# EAGLE schematic Filter Board (EAGLE 9.5.1)
REV#: 1

## Sheet 1 of 5
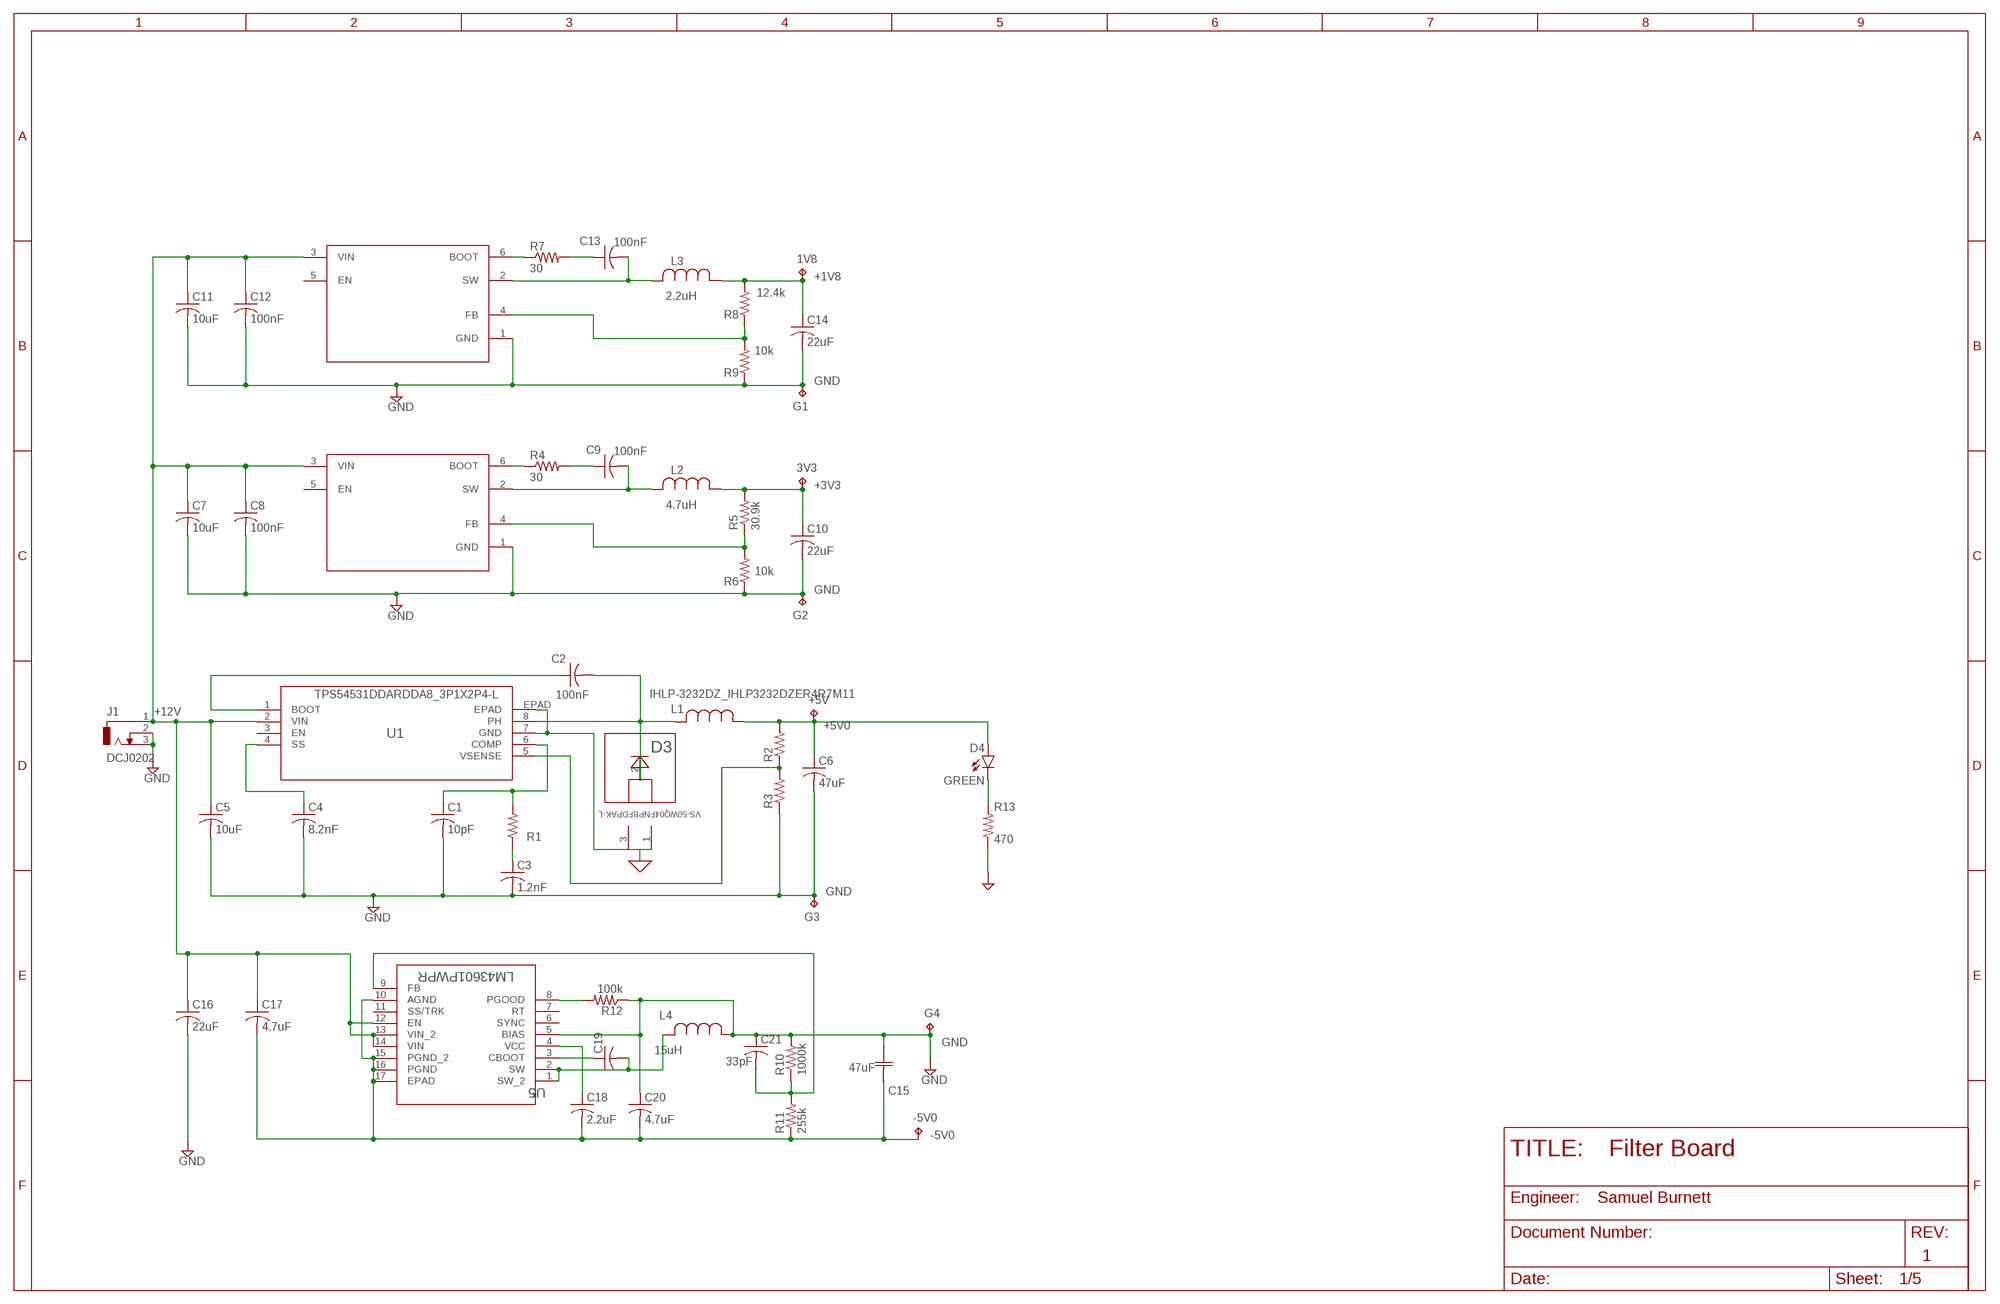
[diagram p0: schematic, sheet 1]
FRAME5 (FRAME_B_L): ENGINEER_NAME: Samuel Burnett

### Parts
1V8  TPPAD1-13  [P1-13]
3V3  TPPAD1-13  [P1-13]
+5V  TPPAD1-13  [P1-13]
-5V0  TPPAD1-13  [P1-13]
C1  10pF  C-USC0805  [C0805]
C2  100nF  C-USC0805  [C0805]
C3  1.2nF  C-USC0805  [C0805]
C4  8.2nF  C-USC1206  [C1206]
C5  10uF  C-USC1210  [C1210]
C6  47uF  C-USC1210  [C1210]
C7  10uF  C-USC0805  [C0805]
C8  100nF  C-USC0805  [C0805]
C9  100nF  C-USC0805  [C0805]
C10  22uF  C-USC0805  [C0805]
C11  10uF  C-USC0805  [C0805]
C12  100nF  C-USC0805  [C0805]
C13  100nF  C-USC0805  [C0805]
C14  22uF  C-USC0805  [C0805]
C15  47uF  CGA9N3X7R1_CGA9N3X7R1C476M230KB  [CGA9N3X7R1_CAP_5750]
C16  22uF  C-USC1210  [C1210]
C17  4.7uF  C-USC0805  [C0805]
C18  2.2uF  C-USC0805  [C0805]
C19  C-USC0805  [C0805]
C20  4.7uF  C-USC0805  [C0805]
C21  33pF  C-USC0805  [C0805]
D3  VS-50WQ04FNPBFDPAK-L  [DPAK-L]
D4  GREEN  LED-BLUE1206  [LED-1206]
G1  TPPAD1-13  [P1-13]
G2  TPPAD1-13  [P1-13]
G3  TPPAD1-13  [P1-13]
G4  TPPAD1-13  [P1-13]
J1  DCJ0202  [DCJ0202]
L1  IHLP-3232DZ_IHLP3232DZER4R7M11  [IHLP-3232DZ_IND_IHLP-3232DZ]
L2  4.7uH  LTF5022T  [IND_5022]
L3  2.2uH  NLCV32T-2R2M-PFR  [IND_NLCV32TR]
L4  15uH  IFSC-1515A_IFSC1515AHER150M01  [IFSC-1515A_IND_IFSC_1515AH]
R1  R-US_R0805  [R0805]
R2  R-US_R0805  [R0805]
R3  R-US_R0805  [R0805]
R4  30  R-US_R0805  [R0805]
R5  30.9k  R-US_R0805  [R0805]
R6  10k  R-US_R0805  [R0805]
R7  30  R-US_R0805  [R0805]
R8  12.4k  R-US_R0805  [R0805]
R9  10k  R-US_R0805  [R0805]
R10  1000k  R-US_R0805  [R0805]
R11  255k  R-US_R0805  [R0805]
R12  100k  R-US_R0805  [R0805]
R13  470  R-US_R0805  [R0805]
U1  TPS54531DDARDDA8_3P1X2P4-L  [DDA8_3P1X2P4-L]
U3  TPS56339  [TSOT23-6_DDC]
U4  TPS56339  [TSOT23-6_DDC]
U5  LM43601PWPR  [PWP16]

### Nets
+1V8 [Power]: 1V8.TP C14.1 L3.1 R8.2 ; also sheet 5
+3V3 [Power]: 3V3.TP C10.1 L2.1 R5.2 ; also sheet 2,5
+5V0 [Power]: +5V.TP C6.1 D4.A L1.1 R2.2 ; also sheet 2,5
+12V: C5.1 C7.1 C8.1 C11.1 C12.1 C16.1 C17.1 J1.1 U1.2(VIN) U3.3(VIN) U4.3(VIN) U5.12(EN) U5.13(VIN_2) U5.14(VIN) ; also sheet 5
-5V0 [Power]: -5V0.TP C15.2 C17.2 C18.2 C20.2 R11.1 U5.10(AGND) U5.15(PGND_2) U5.16(PGND) U5.17(EPAD) ; also sheet 2,5
BOOT: C19.1 U5.3(CBOOT)
FB: C21.2 R10.1 R11.2 U5.9(FB)
GND [GND]: C1.2 C3.2 C4.2 C5.2 C6.2 C7.2 C8.2 C10.2 C11.2 C12.2 C14.2 C15.1 C16.2 C20.1 C21.1 D3.1 D3.3 G1.TP G2.TP G3.TP G4.TP J1.2 J1.3 L4.1 R3.1 R6.1 R9.1 R10.2 R12.1 R13.1 U1.7(GND) U1.EPAD U3.1(GND) U4.1(GND) U5.5(BIAS) ; also sheet 2,3,4,5
N$1: C3.1 R1.1
N$2: R2.1 R3.2 U1.5(VSENSE)
N$3: C2.1 U1.1(BOOT)
N$4: C2.2 D3.2 L1.2 U1.8(PH)
N$5: C4.1 U1.4(SS)
N$6: C1.1 R1.2 U1.6(COMP)
N$7: R4.1 U3.6(BOOT)
N$8: C9.1 R4.2
N$9: C9.2 L2.2 U3.2(SW)
N$10: R7.1 U4.6(BOOT)
N$11: R5.1 R6.2 U3.4(FB)
N$12: C13.1 R7.2
N$13: C13.2 L3.2 U4.2(SW)
N$14: R8.1 R9.2 U4.4(FB)
N$18: C18.1 U5.4(VCC)
N$60: D4.C R13.2
PGOOD: R12.2 U5.8(PGOOD)
SW: C19.2 L4.2 U5.1(SW_2) U5.2(SW)
Unconnected: U1.3(EN) U3.5(EN) U4.5(EN) U5.6(SYNC) U5.7(RT) U5.11(SS/TRK)

## Sheet 2 of 5
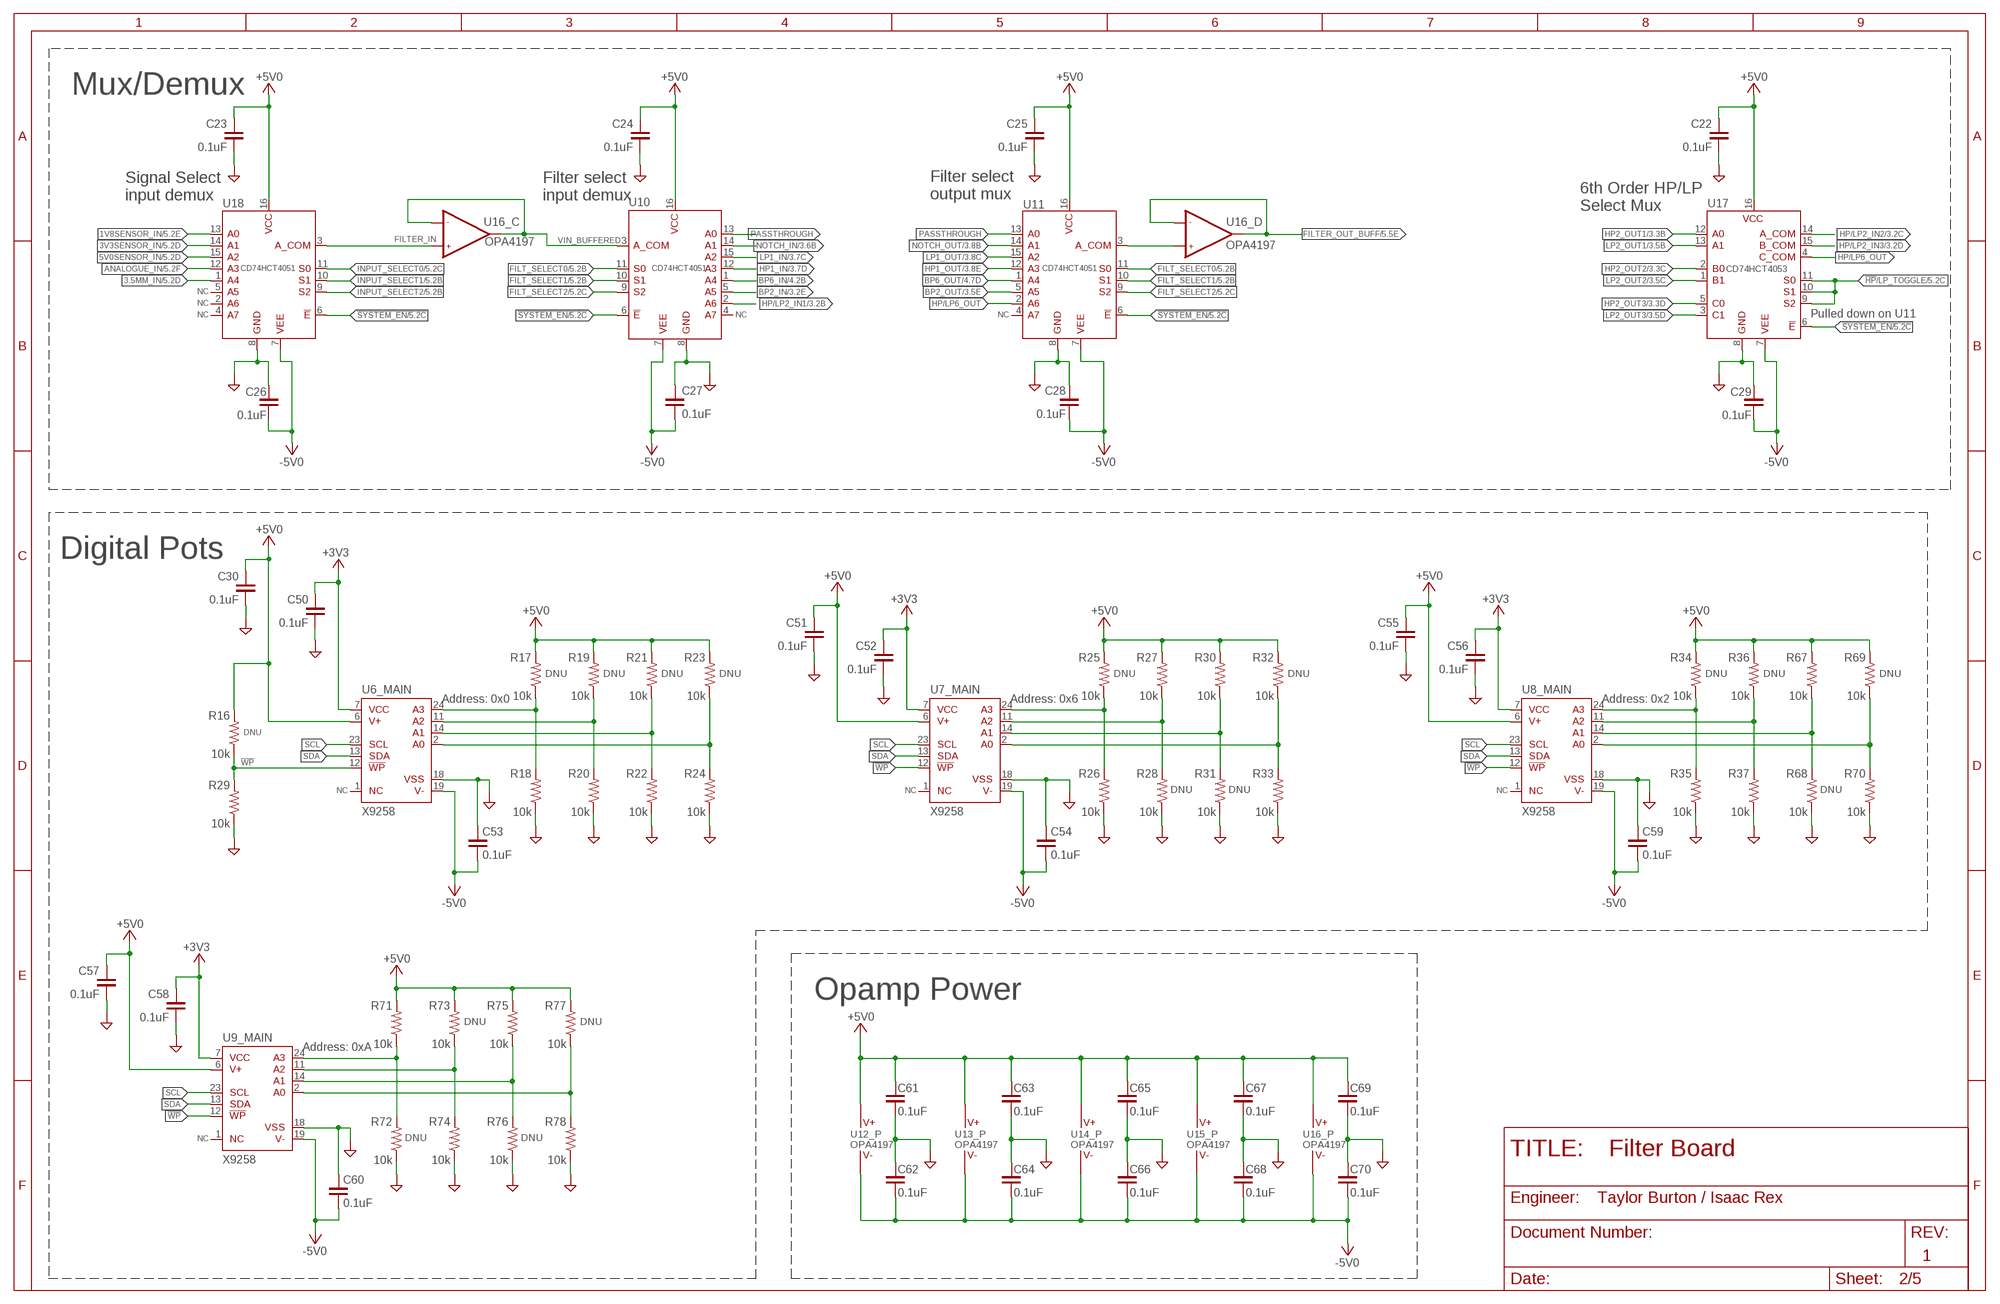
[diagram p1: schematic, sheet 2]
FRAME1 (FRAME_B_L): ENGINEER_NAME: Taylor Burton / Isaac Rex

### Parts
C22  0.1uF  NON_POL_0805/2012  [0805_H0.75]
C23  0.1uF  NON_POL_0805/2012  [0805_H0.75]
C24  0.1uF  NON_POL_0805/2012  [0805_H0.75]
C25  0.1uF  NON_POL_0805/2012  [0805_H0.75]
C26  0.1uF  NON_POL_0805/2012  [0805_H0.75]
C27  0.1uF  NON_POL_0805/2012  [0805_H0.75]
C28  0.1uF  NON_POL_0805/2012  [0805_H0.75]
C29  0.1uF  NON_POL_0805/2012  [0805_H0.75]
C30  0.1uF  NON_POL_0805/2012  [0805_H0.75]
C50  0.1uF  NON_POL_0805/2012  [0805_H0.75]
C51  0.1uF  NON_POL_0805/2012  [0805_H0.75]
C52  0.1uF  NON_POL_0805/2012  [0805_H0.75]
C53  0.1uF  NON_POL_0805/2012  [0805_H0.75]
C54  0.1uF  NON_POL_0805/2012  [0805_H0.75]
C55  0.1uF  NON_POL_0805/2012  [0805_H0.75]
C56  0.1uF  NON_POL_0805/2012  [0805_H0.75]
C57  0.1uF  NON_POL_0805/2012  [0805_H0.75]
C58  0.1uF  NON_POL_0805/2012  [0805_H0.75]
C59  0.1uF  NON_POL_0805/2012  [0805_H0.75]
C60  0.1uF  NON_POL_0805/2012  [0805_H0.75]
C61  0.1uF  NON_POL_0805/2012  [0805_H0.75]
C62  0.1uF  NON_POL_0805/2012  [0805_H0.75]
C63  0.1uF  NON_POL_0805/2012  [0805_H0.75]
C64  0.1uF  NON_POL_0805/2012  [0805_H0.75]
C65  0.1uF  NON_POL_0805/2012  [0805_H0.75]
C66  0.1uF  NON_POL_0805/2012  [0805_H0.75]
C67  0.1uF  NON_POL_0805/2012  [0805_H0.75]
C68  0.1uF  NON_POL_0805/2012  [0805_H0.75]
C69  0.1uF  NON_POL_0805/2012  [0805_H0.75]
C70  0.1uF  NON_POL_0805/2012  [0805_H0.75]
R16  10k  SMD_0805  [0805]
R17  10k  SMD_0805  [0805]
R18  10k  SMD_0805  [0805]
R19  10k  SMD_0805  [0805]
R20  10k  SMD_0805  [0805]
R21  10k  SMD_0805  [0805]
R22  10k  SMD_0805  [0805]
R23  10k  SMD_0805  [0805]
R24  10k  SMD_0805  [0805]
R25  10k  SMD_0805  [0805]
R26  10k  SMD_0805  [0805]
R27  10k  SMD_0805  [0805]
R28  10k  SMD_0805  [0805]
R29  10k  SMD_0805  [0805]
R30  10k  SMD_0805  [0805]
R31  10k  SMD_0805  [0805]
R32  10k  SMD_0805  [0805]
R33  10k  SMD_0805  [0805]
R34  10k  SMD_0805  [0805]
R35  10k  SMD_0805  [0805]
R36  10k  SMD_0805  [0805]
R37  10k  SMD_0805  [0805]
R67  10k  SMD_0805  [0805]
R68  10k  SMD_0805  [0805]
R69  10k  SMD_0805  [0805]
R70  10k  SMD_0805  [0805]
R71  10k  SMD_0805  [0805]
R72  10k  SMD_0805  [0805]
R73  10k  SMD_0805  [0805]
R74  10k  SMD_0805  [0805]
R75  10k  SMD_0805  [0805]
R76  10k  SMD_0805  [0805]
R77  10k  SMD_0805  [0805]
R78  10k  SMD_0805  [0805]
U6  X9258  X9258_SOIC  [SOIC127P1030X250-25T200X300]
U7  X9258  X9258_SOIC  [SOIC127P1030X250-25T200X300]
U8  X9258  X9258_SOIC  [SOIC127P1030X250-25T200X300]
U9  X9258  X9258_SOIC  [SOIC127P1030X250-25T200X300]
U10  CD74HCT4051  [SOIC127P600X144-16]
U11  CD74HCT4051  [SOIC127P600X144-16]
U12  OPA4197  OPA4197_SOIC14  [SOIC127P600X144-14]
U13  OPA4197  OPA4197_SOIC14  [SOIC127P600X144-14]
U14  OPA4197  OPA4197_SOIC14  [SOIC127P600X144-14]
U15  OPA4197  OPA4197_SOIC14  [SOIC127P600X144-14]
U16  OPA4197  OPA4197_SOIC14  [SOIC127P600X144-14]
U17  CD74HCT4053  CD74HCT4053_SOIC16  [SOIC127P600X144-16]
U18  CD74HCT4051  [SOIC127P600X144-16]

### Nets
1V8SENSOR_IN: U18.13(A0) ; also sheet 5
3.5MM_IN: U18.1(A4) ; also sheet 5
3V3SENSOR_IN: U18.14(A1) ; also sheet 5
5V0SENSOR_IN: U18.15(A2) ; also sheet 5
!HP!/LP_TOGGLE: U17.9(S2) U17.10(S1) U17.11(S0) ; also sheet 5
!SYSTEM_EN: U10.6(!E) U11.6(!E) U17.6(!E) U18.6(!E) ; also sheet 5
!WP: R16.1 R29.2 U6.12(_MAIN:!WP) U7.12(_MAIN:!WP) U8.12(_MAIN:!WP) U9.12(_MAIN:!WP)
+3V3 [Power]: C50.1 C52.1 C56.1 C58.1 U6.7(_MAIN:VCC) U7.7(_MAIN:VCC) U8.7(_MAIN:VCC) U9.7(_MAIN:VCC) ; also sheet 1,5
+5V0 [Power]: C22.1 C23.1 C24.1 C25.1 C30.1 C51.1 C55.1 C57.1 C61.1 C63.1 C65.1 C67.1 C69.1 R16.2 R17.2 R19.2 R21.2 R23.2 R25.2 R27.2 R30.2 R32.2 R34.2 R36.2 R67.2 R69.2 R71.2 R73.2 R75.2 R77.2 U6.6(_MAIN:V+) U7.6(_MAIN:V+) U8.6(_MAIN:V+) U9.6(_MAIN:V+) U10.16(VCC) U11.16(VCC) U12.4(_P:V+) U13.4(_P:V+) U14.4(_P:V+) U15.4(_P:V+) U16.4(_P:V+) U17.16(VCC) U18.16(VCC) ; also sheet 1,5
-5V0 [Power]: C26.2 C27.1 C28.2 C29.2 C53.2 C54.2 C59.2 C60.2 C62.2 C64.2 C66.2 C68.2 C70.2 U6.19(_MAIN:V-) U7.19(_MAIN:V-) U8.19(_MAIN:V-) U9.19(_MAIN:V-) U10.7(VEE) U11.7(VEE) U12.11(_P:V-) U13.11(_P:V-) U14.11(_P:V-) U15.11(_P:V-) U16.11(_P:V-) U17.7(VEE) U18.7(VEE) ; also sheet 1,5
ANALOGUE_IN: U18.12(A3) ; also sheet 5
BP2_IN: U10.5(A5) ; also sheet 3
BP2_OUT: U11.5(A5) ; also sheet 3
BP6_IN: U10.1(A4) ; also sheet 4
BP6_OUT: U11.1(A4) ; also sheet 4
FILT_SELECT0: U10.11(S0) U11.11(S0) ; also sheet 5
FILT_SELECT1: U10.10(S1) U11.10(S1) ; also sheet 5
FILT_SELECT2: U10.9(S2) U11.9(S2) ; also sheet 5
FILTER_IN: U16.10(_C:+IN) U18.3(A_COM)
FILTER_OUT_BUFF: U16.13(_D:-IN) U16.14(_D:OUT) ; also sheet 5
GND [GND]: C22.2 C23.2 C24.2 C25.2 C26.1 C27.2 C28.1 C29.1 C30.2 C50.2 C51.2 C52.2 C53.1 C54.1 C55.2 C56.2 C57.2 C58.2 C59.1 C60.1 C61.2 C62.1 C63.2 C64.1 C65.2 C66.1 C67.2 C68.1 C69.2 C70.1 R18.1 R20.1 R22.1 R24.1 R26.1 R28.1 R29.1 R31.1 R33.1 R35.1 R37.1 R68.1 R70.1 R72.1 R74.1 R76.1 R78.1 U6.18(_MAIN:VSS) U7.18(_MAIN:VSS) U8.18(_MAIN:VSS) U9.18(_MAIN:VSS) U10.8(GND) U11.8(GND) U17.8(GND) U18.8(GND) ; also sheet 1,3,4,5
HP1_IN: U10.12(A3) ; also sheet 3
HP1_OUT: U11.12(A3) ; also sheet 3
HP2_OUT1: U17.12(A0) ; also sheet 3
HP2_OUT2: U17.2(B0) ; also sheet 3
HP2_OUT3: U17.5(C0) ; also sheet 3
HP/LP2_IN1: U10.2(A6) ; also sheet 3
HP/LP2_IN2: U17.14(A_COM) ; also sheet 3
HP/LP2_IN3: U17.15(B_COM) ; also sheet 3
HP/LP6_OUT: U11.2(A6) U17.4(C_COM)
INPUT_SELECT0: U18.11(S0) ; also sheet 5
INPUT_SELECT1: U18.10(S1) ; also sheet 5
INPUT_SELECT2: U18.9(S2) ; also sheet 5
LP1_IN: U10.15(A2) ; also sheet 3
LP1_OUT: U11.15(A2) ; also sheet 3
LP2_OUT1: U17.13(A1) ; also sheet 3
LP2_OUT2: U17.1(B1) ; also sheet 3
LP2_OUT3: U17.3(C1) ; also sheet 3
N$27: R17.1 R18.2 U6.24(_MAIN:A3)
N$33: R19.1 R20.2 U6.11(_MAIN:A2)
N$39: R21.1 R22.2 U6.14(_MAIN:A1)
N$43: U11.3(A_COM) U16.12(_D:+IN)
N$44: R23.1 R24.2 U6.2(_MAIN:A0)
N$45: R25.1 R26.2 U7.24(_MAIN:A3)
N$46: R27.1 R28.2 U7.11(_MAIN:A2)
N$47: R30.1 R31.2 U7.14(_MAIN:A1)
N$48: R32.1 R33.2 U7.2(_MAIN:A0)
N$49: R34.1 R35.2 U8.24(_MAIN:A3)
N$50: R36.1 R37.2 U8.11(_MAIN:A2)
N$51: R67.1 R68.2 U8.14(_MAIN:A1)
N$52: R69.1 R70.2 U8.2(_MAIN:A0)
N$53: R71.1 R72.2 U9.24(_MAIN:A3)
N$54: R73.1 R74.2 U9.11(_MAIN:A2)
N$55: R75.1 R76.2 U9.14(_MAIN:A1)
N$56: R77.1 R78.2 U9.2(_MAIN:A0)
NOTCH_IN: U10.14(A1) ; also sheet 3
NOTCH_OUT: U11.14(A1) ; also sheet 3
PASSTHROUGH: U10.13(A0) U11.13(A0)
SCL: U6.23(_MAIN:SCL) U7.23(_MAIN:SCL) U8.23(_MAIN:SCL) U9.23(_MAIN:SCL) ; also sheet 5
SDA: U6.13(_MAIN:SDA) U7.13(_MAIN:SDA) U8.13(_MAIN:SDA) U9.13(_MAIN:SDA) ; also sheet 5
VIN_BUFFERED: U10.3(A_COM) U16.8(_C:OUT) U16.9(_C:-IN)
Unconnected: U6.1(_MAIN:NC) U7.1(_MAIN:NC) U8.1(_MAIN:NC) U9.1(_MAIN:NC) U10.4(A7) U11.4(A7) U18.2(A6) U18.4(A7) U18.5(A5)

### Notes on the sheet
- Mux/Demux
- Filter select 
  output mux
- Signal Select
  input demux
- Filter select 
  input demux
- 6th Order HP/LP 
  Select Mux
- NC
- NC
- NC | NC | NC | Pulled down on U11
- Digital Pots
- Address: 0x0 | Address: 0x6 | Address: 0x2
- NC | NC | NC
- Opamp Power
- Address: 0xA
- NC

## Sheet 3 of 5: Filters 6th Order Bandpass Notch 1st Order Lowpass 1st Order Highpass 2nd Order Bandpass
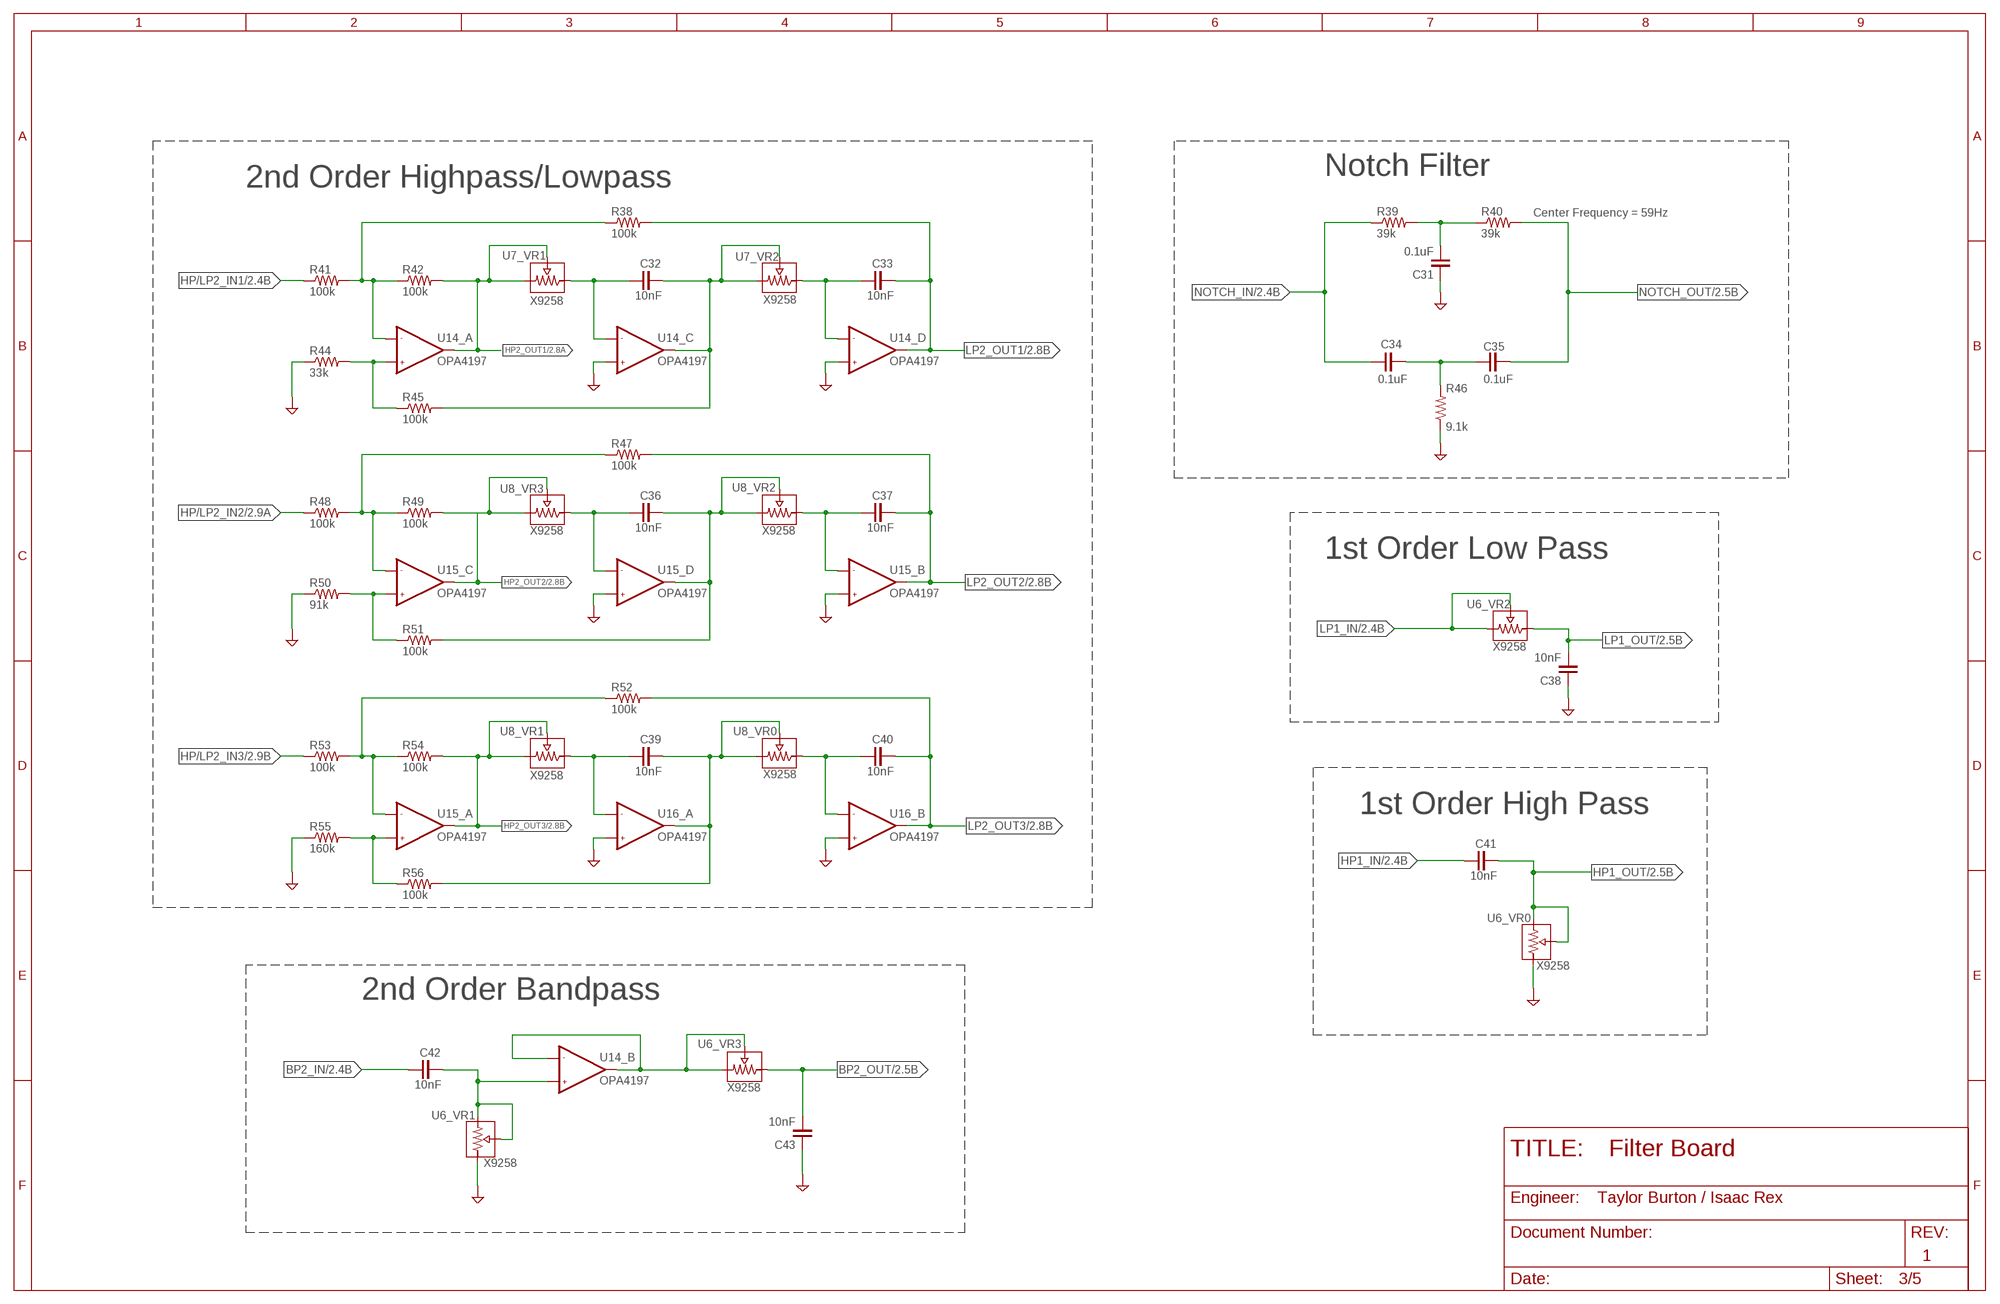
[diagram p2: schematic, sheet 3]
FRAME2 (FRAME_B_L): ENGINEER_NAME: Taylor Burton / Isaac Rex

### Parts
C31  0.1uF  NON_POL_0805/2012  [0805_H0.75]
C32  10nF  NON_POL_0805/2012  [0805_H0.75]
C33  10nF  NON_POL_0805/2012  [0805_H0.75]
C34  0.1uF  NON_POL_0805/2012  [0805_H0.75]
C35  0.1uF  NON_POL_0805/2012  [0805_H0.75]
C36  10nF  NON_POL_0805/2012  [0805_H0.75]
C37  10nF  NON_POL_0805/2012  [0805_H0.75]
C38  10nF  NON_POL_0805/2012  [0805_H0.75]
C39  10nF  NON_POL_0805/2012  [0805_H0.75]
C40  10nF  NON_POL_0805/2012  [0805_H0.75]
C41  10nF  NON_POL_0805/2012  [0805_H0.75]
C42  10nF  NON_POL_0805/2012  [0805_H0.75]
C43  10nF  NON_POL_0805/2012  [0805_H0.75]
R38  100k  SMD_0805  [0805]
R39  39k  SMD_0805  [0805]
R40  39k  SMD_0805  [0805]
R41  100k  SMD_0805  [0805]
R42  100k  SMD_0805  [0805]
R44  33k  SMD_0805  [0805]
R45  100k  SMD_0805  [0805]
R46  9.1k  SMD_0805  [0805]
R47  100k  SMD_0805  [0805]
R48  100k  SMD_0805  [0805]
R49  100k  SMD_0805  [0805]
R50  91k  SMD_0805  [0805]
R51  100k  SMD_0805  [0805]
R52  100k  SMD_0805  [0805]
R53  100k  SMD_0805  [0805]
R54  100k  SMD_0805  [0805]
R55  160k  SMD_0805  [0805]
R56  100k  SMD_0805  [0805]

### Nets
BP2_IN: C42.1 ; also sheet 2
BP2_OUT: C43.2 U6.5(_VR3:L) ; also sheet 2
GND [GND]: C31.1 C38.1 C43.1 R44.1 R46.1 R50.1 R55.1 U6.8(_VR0:L) U6.15(_VR1:L) U14.10(_C:+IN) U14.12(_D:+IN) U15.5(_B:+IN) U15.12(_D:+IN) U16.3(_A:+IN) U16.5(_B:+IN) ; also sheet 1,2,4,5
HP1_IN: C41.1 ; also sheet 2
HP1_OUT: C41.2 U6.9(_VR0:H) U6.10(_VR0:W) ; also sheet 2
HP2_OUT1: R42.2 U7.16(_VR1:H) U7.17(_VR1:W) U14.1(_A:OUT) ; also sheet 2
HP2_OUT2: R49.2 U8.3(_VR3:W) U8.4(_VR3:H) U15.8(_C:OUT) ; also sheet 2
HP2_OUT3: R54.2 U8.16(_VR1:H) U8.17(_VR1:W) U15.1(_A:OUT) ; also sheet 2
HP/LP2_IN1: R41.1 ; also sheet 2
HP/LP2_IN2: R48.1 ; also sheet 2
HP/LP2_IN3: R53.1 ; also sheet 2
LP1_IN: U6.20(_VR2:W) U6.21(_VR2:H) ; also sheet 2
LP1_OUT: C38.2 U6.22(_VR2:L) ; also sheet 2
LP2_OUT1: C33.2 R38.2 U14.14(_D:OUT) ; also sheet 2
LP2_OUT2: C37.2 R47.2 U15.7(_B:OUT) ; also sheet 2
LP2_OUT3: C40.2 R52.2 U16.7(_B:OUT) ; also sheet 2
N$17: C31.2 R39.2 R40.1
N$21: C34.2 C35.1 R46.2
N$22: C42.2 U6.16(_VR1:H) U6.17(_VR1:W) U14.5(_B:+IN)
N$23: U6.3(_VR3:W) U6.4(_VR3:H) U14.6(_B:-IN) U14.7(_B:OUT)
N$25: R44.2 R45.1 U14.3(_A:+IN)
N$26: R38.1 R41.2 R42.1 U14.2(_A:-IN)
N$28: C32.1 U7.15(_VR1:L) U14.9(_C:-IN)
N$29: C32.2 R45.2 U7.20(_VR2:W) U7.21(_VR2:H) U14.8(_C:OUT)
N$30: C33.1 U7.22(_VR2:L) U14.13(_D:-IN)
N$31: R50.2 R51.1 U15.10(_C:+IN)
N$32: R47.1 R48.2 R49.1 U15.9(_C:-IN)
N$34: C36.1 U8.5(_VR3:L) U15.13(_D:-IN)
N$35: C36.2 R51.2 U8.20(_VR2:W) U8.21(_VR2:H) U15.14(_D:OUT)
N$36: C37.1 U8.22(_VR2:L) U15.6(_B:-IN)
N$37: R55.2 R56.1 U15.3(_A:+IN)
N$38: R52.1 R53.2 R54.1 U15.2(_A:-IN)
N$40: C39.1 U8.15(_VR1:L) U16.2(_A:-IN)
N$41: C39.2 R56.2 U8.9(_VR0:H) U8.10(_VR0:W) U16.1(_A:OUT)
N$42: C40.1 U8.8(_VR0:L) U16.6(_B:-IN)
NOTCH_IN: C34.1 R39.1 ; also sheet 2
NOTCH_OUT: C35.2 R40.2 ; also sheet 2

### Notes on the sheet
- Notch Filter
- 2nd Order Highpass/Lowpass
- Center Frequency = 59Hz
- 1st Order Low Pass
- 1st Order High Pass
- 2nd Order Bandpass

## Sheet 4 of 5: 6th Order Bandpass Filter
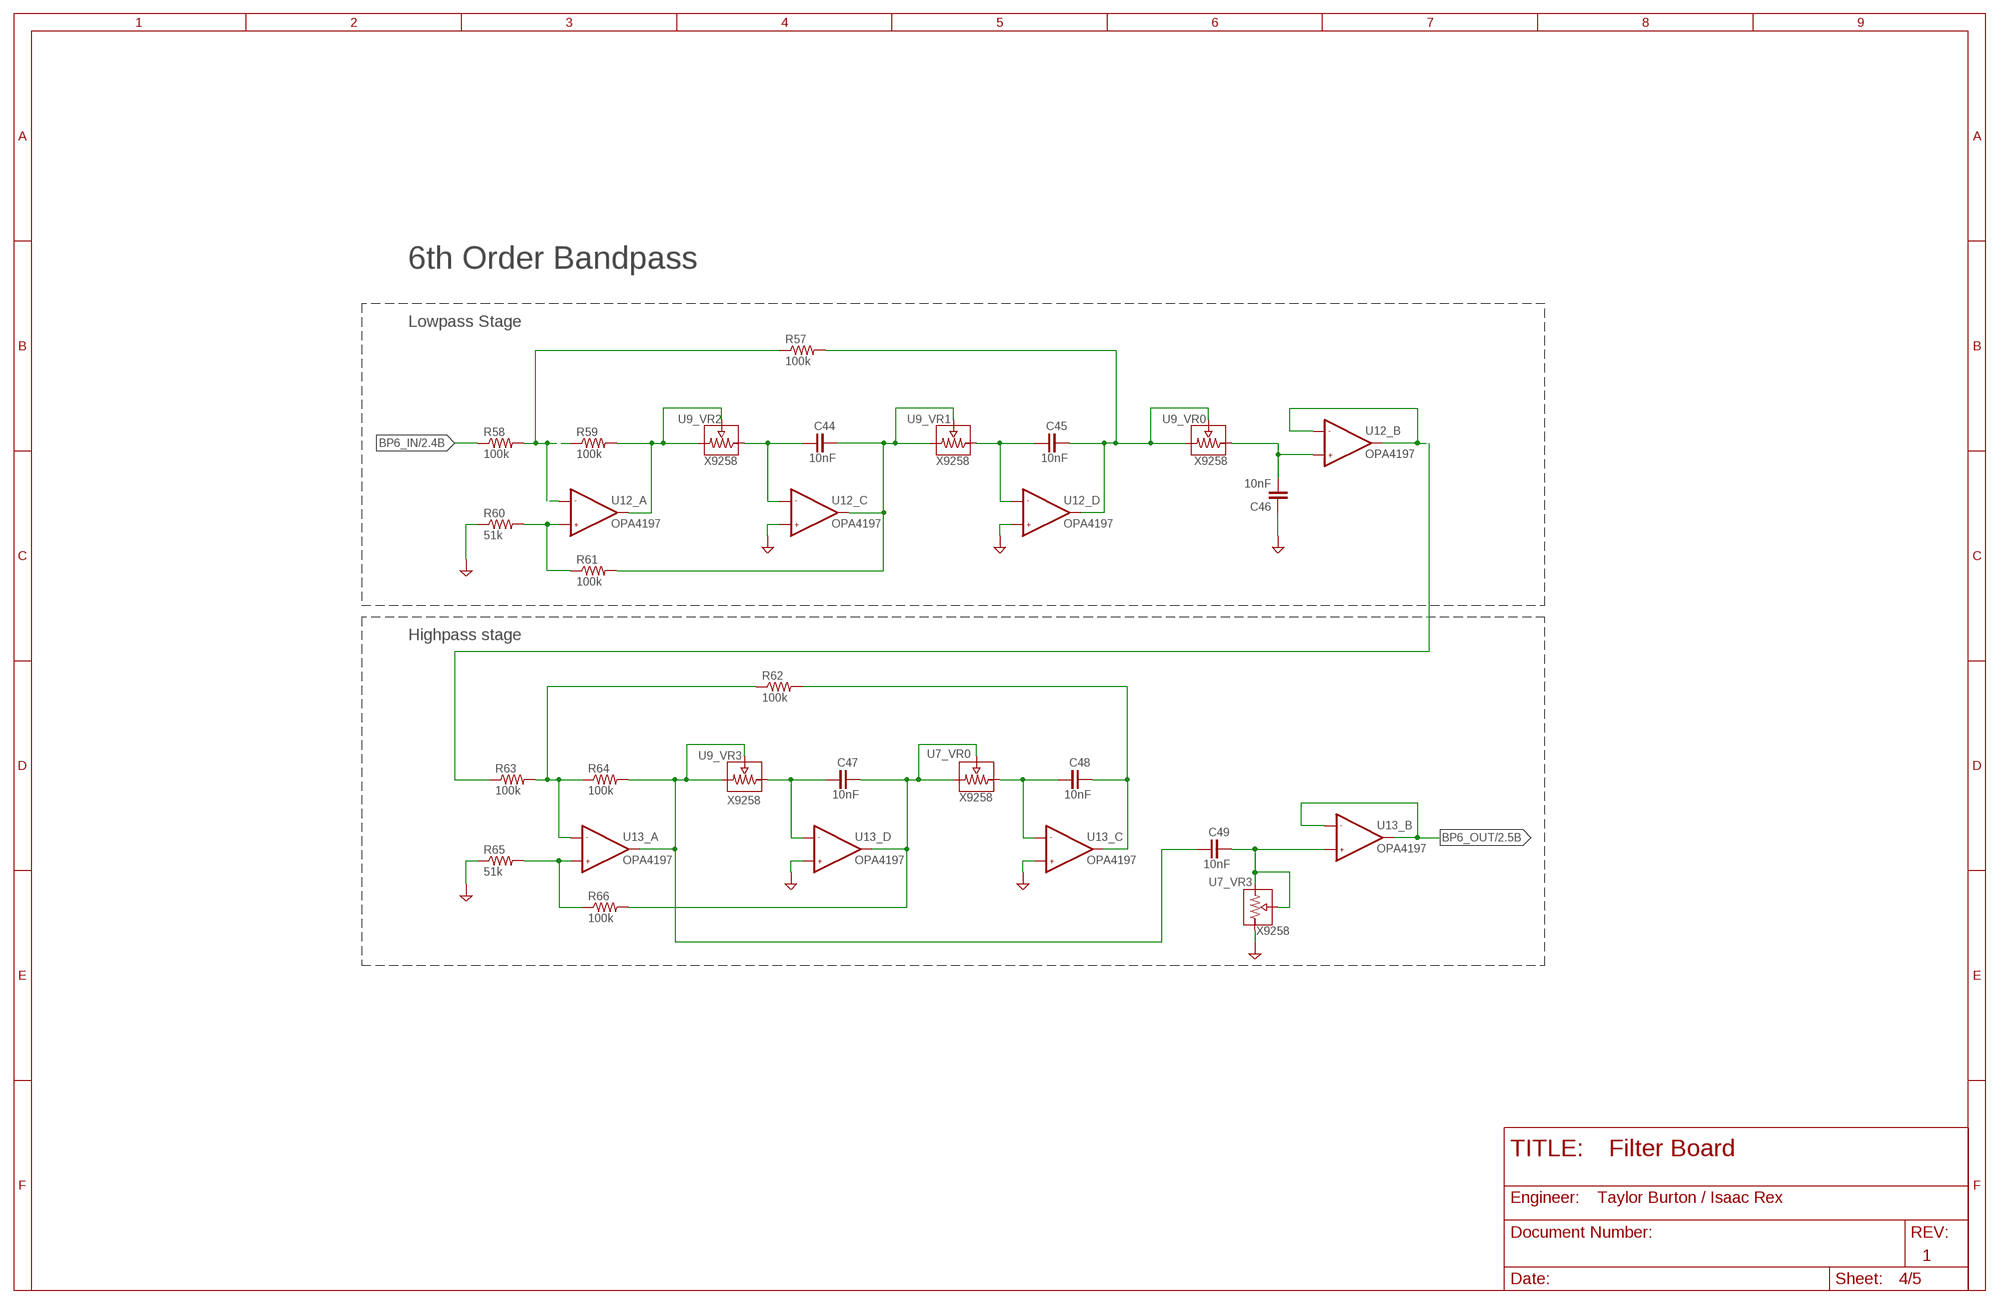
[diagram p3: schematic, sheet 4]
FRAME3 (FRAME_B_L): ENGINEER_NAME: Taylor Burton / Isaac Rex

### Parts
C44  10nF  NON_POL_0805/2012  [0805_H0.75]
C45  10nF  NON_POL_0805/2012  [0805_H0.75]
C46  10nF  NON_POL_0805/2012  [0805_H0.75]
C47  10nF  NON_POL_0805/2012  [0805_H0.75]
C48  10nF  NON_POL_0805/2012  [0805_H0.75]
C49  10nF  NON_POL_0805/2012  [0805_H0.75]
R57  100k  SMD_0805  [0805]
R58  100k  SMD_0805  [0805]
R59  100k  SMD_0805  [0805]
R60  51k  SMD_0805  [0805]
R61  100k  SMD_0805  [0805]
R62  100k  SMD_0805  [0805]
R63  100k  SMD_0805  [0805]
R64  100k  SMD_0805  [0805]
R65  51k  SMD_0805  [0805]
R66  100k  SMD_0805  [0805]

### Nets
BP6_HPOUT: C44.2 R61.2 U9.16(_VR1:H) U9.17(_VR1:W) U12.8(_C:OUT)
BP6_IN: R58.1 ; also sheet 2
BP6_OUT: U13.6(_B:-IN) U13.7(_B:OUT) ; also sheet 2
GND [GND]: C46.1 R60.1 R65.1 U7.5(_VR3:L) U12.10(_C:+IN) U12.12(_D:+IN) U13.10(_C:+IN) U13.12(_D:+IN) ; also sheet 1,2,3,5
N$24: R57.1 R58.2 R59.1 U12.2(_A:-IN)
N$57: R60.2 R61.1 U12.3(_A:+IN)
N$58: R59.2 U9.20(_VR2:W) U9.21(_VR2:H) U12.1(_A:OUT)
N$59: C44.1 U9.22(_VR2:L) U12.9(_C:-IN)
N$61: C45.1 U9.15(_VR1:L) U12.13(_D:-IN)
N$62: C45.2 R57.2 U9.9(_VR0:H) U9.10(_VR0:W) U12.14(_D:OUT)
N$63: C46.2 U9.8(_VR0:L) U12.5(_B:+IN)
N$64: R63.1 U12.6(_B:-IN) U12.7(_B:OUT)
N$65: R62.1 R63.2 R64.1 U13.2(_A:-IN)
N$66: R65.2 R66.1 U13.3(_A:+IN)
N$67: C49.1 R64.2 U9.3(_VR3:W) U9.4(_VR3:H) U13.1(_A:OUT)
N$68: C47.1 U9.5(_VR3:L) U13.13(_D:-IN)
N$69: C47.2 R66.2 U7.9(_VR0:H) U7.10(_VR0:W) U13.14(_D:OUT)
N$70: C48.1 U7.8(_VR0:L) U13.9(_C:-IN)
N$71: C48.2 R62.2 U13.8(_C:OUT)
N$72: C49.2 U7.3(_VR3:W) U7.4(_VR3:H) U13.5(_B:+IN)

### Notes on the sheet
- 6th Order Bandpass
- Lowpass Stage
- Highpass stage

## Sheet 5 of 5
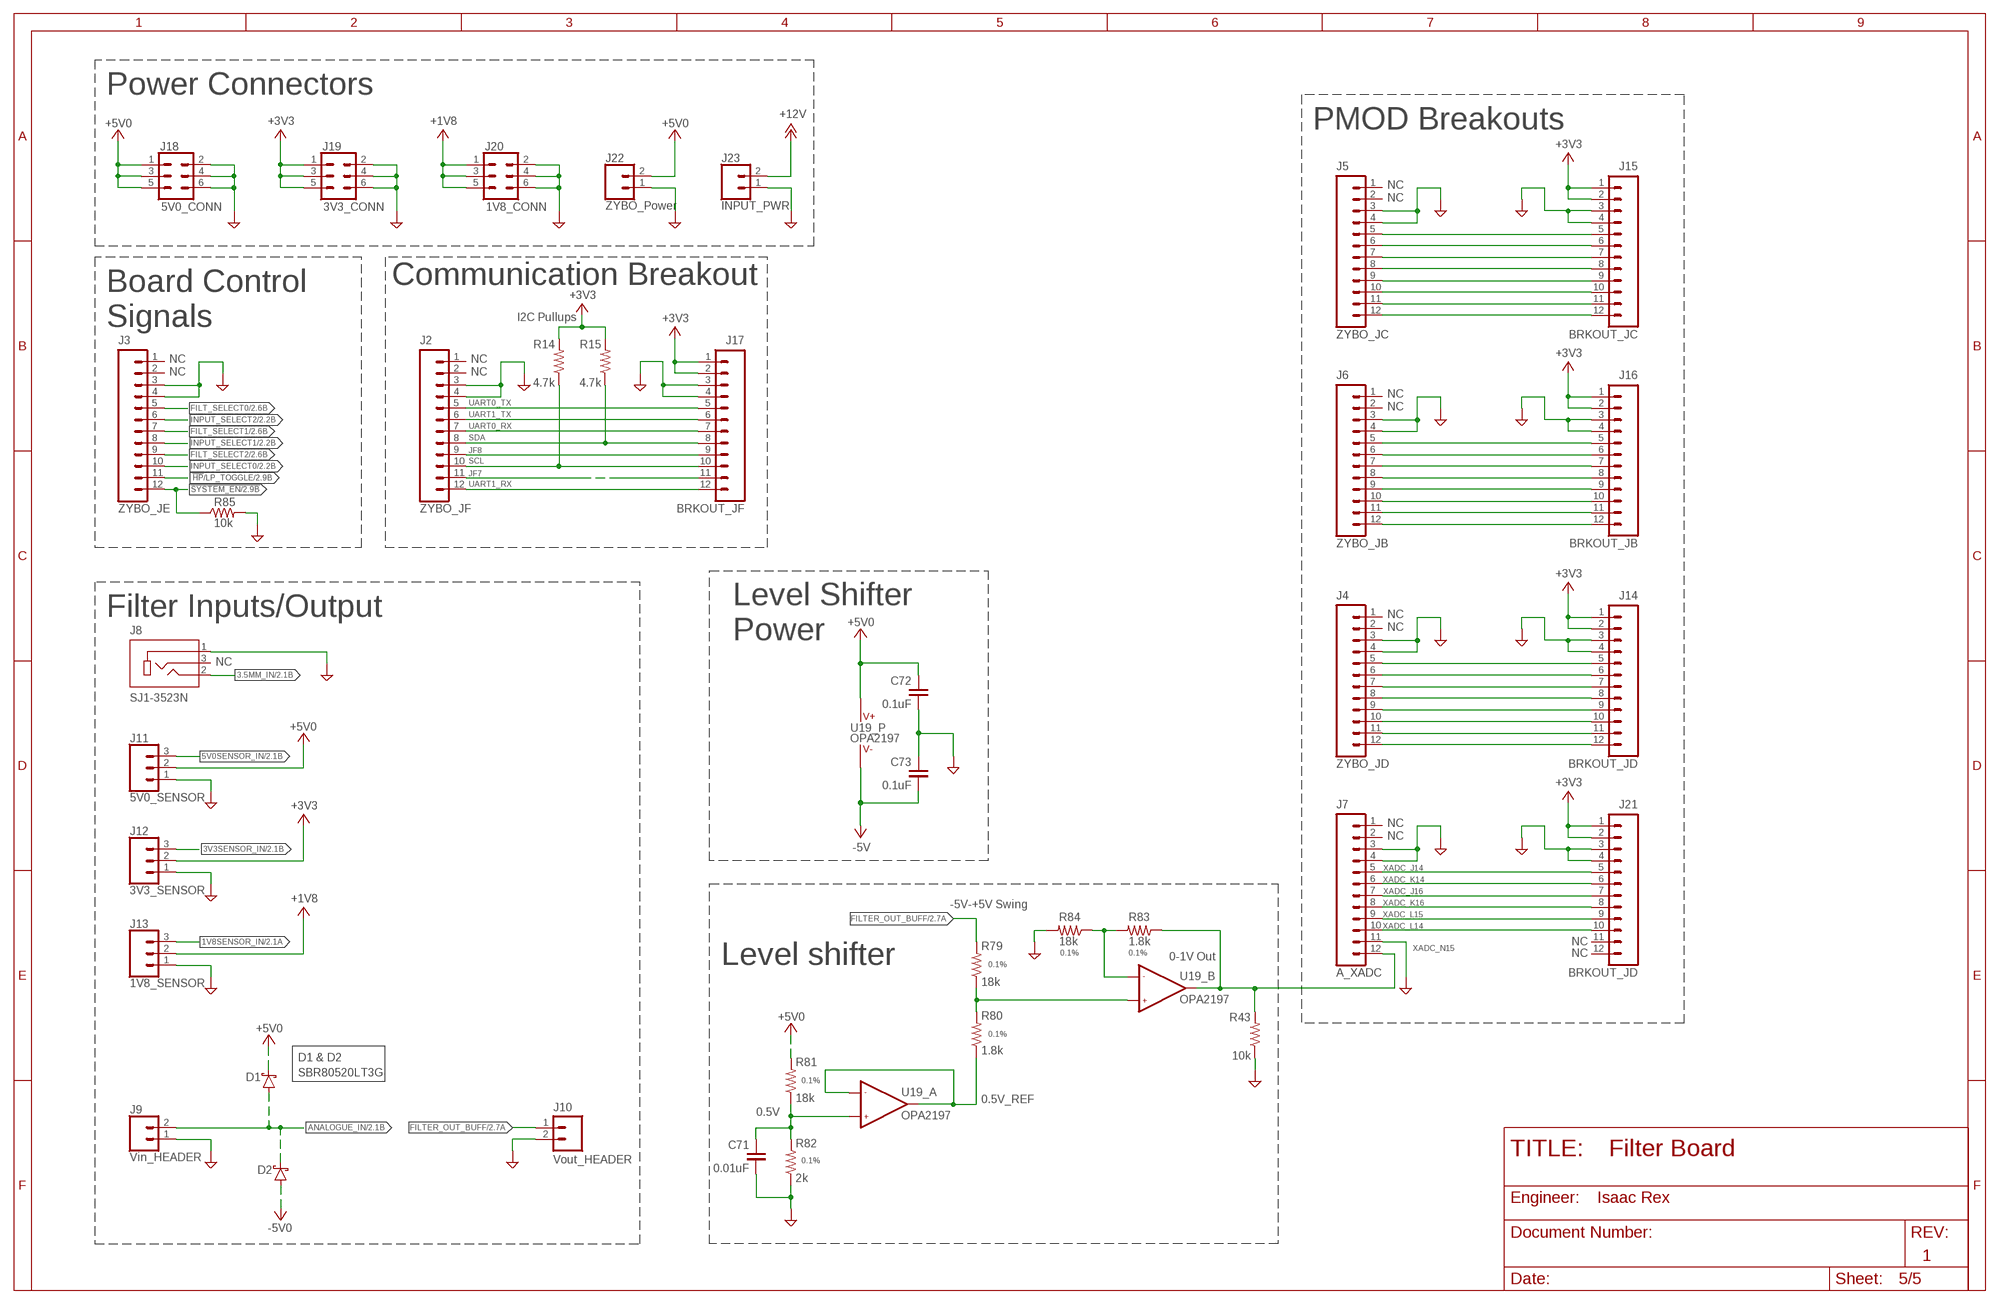
[diagram p4: schematic, sheet 5]
FRAME4 (FRAME_B_L): ENGINEER_NAME: Isaac Rex

### Parts
C71  0.01uF  NON_POL_0805/2012  [0805_H0.75]
C72  0.1uF  NON_POL_0805/2012  [0805_H0.75]
C73  0.1uF  NON_POL_0805/2012  [0805_H0.75]
D1  SBR80520LT3G  SCHOTTKY_DIODE_SOD123  [SOD123]
D2  SBR80520LT3G  SCHOTTKY_DIODE_SOD123  [SOD123]
J2  ZYBO_JF  FEMALE_HEADER-2X6  [FEMALE_HEADER-2X6]
J3  ZYBO_JE  FEMALE_HEADER-2X6  [FEMALE_HEADER-2X6]
J4  ZYBO_JD  FEMALE_HEADER-2X6  [FEMALE_HEADER-2X6]
J5  ZYBO_JC  FEMALE_HEADER-2X6  [FEMALE_HEADER-2X6]
J6  ZYBO_JB  FEMALE_HEADER-2X6  [FEMALE_HEADER-2X6]
J7  A_XADC  FEMALE_HEADER-2X6  [FEMALE_HEADER-2X6]
J8  SJ1-3523N  [CUI_SJ1-3523N]
J9  Vin_HEADER  CONN_02LOCK  [1X02_LOCK]
J10  Vout_HEADER  CONN_02LOCK  [1X02_LOCK]
J11  5V0_SENSOR  CONN_03LOCK  [1X03_LOCK]
J12  3V3_SENSOR  CONN_03LOCK  [1X03_LOCK]
J13  1V8_SENSOR  CONN_03LOCK  [1X03_LOCK]
J14  BRKOUT_JD  FEMALE_HEADER-2X6  [FEMALE_HEADER-2X6]
J15  BRKOUT_JC  FEMALE_HEADER-2X6  [FEMALE_HEADER-2X6]
J16  BRKOUT_JB  FEMALE_HEADER-2X6  [FEMALE_HEADER-2X6]
J17  BRKOUT_JF  FEMALE_HEADER-2X6  [FEMALE_HEADER-2X6]
J18  5V0_CONN  CONN_03X2FEMALE  [2X3]
J19  3V3_CONN  CONN_03X2FEMALE  [2X3]
J20  1V8_CONN  CONN_03X2FEMALE  [2X3]
J21  BRKOUT_JD  FEMALE_HEADER-2X6  [FEMALE_HEADER-2X6]
J22  ZYBO_Power  CONN_02LOCK  [1X02_LOCK]
J23  INPUT_PWR  CONN_02LOCK  [1X02_LOCK]
R14  4.7k  SMD_0805  [0805]
R15  4.7k  SMD_0805  [0805]
R43  10k  SMD_0805  [0805]
R79  18k  SMD_0805  [0805]
R80  1.8k  SMD_0805  [0805]
R81  18k  SMD_0805  [0805]
R82  2k  SMD_0805  [0805]
R83  1.8k  SMD_0805  [0805]
R84  18k  SMD_0805  [0805]
R85  10k  SMD_0805  [0805]
U19  OPA2197  [SO08]

### Nets
0.5V_REF: R80.1 U19.1(_A:OUT) U19.2(_A:-IN)
1V8SENSOR_IN: J13.3 ; also sheet 2
3.5MM_IN: J8.2 ; also sheet 2
3V3SENSOR_IN: J12.3 ; also sheet 2
5V0SENSOR_IN: J11.3 ; also sheet 2
!HP!/LP_TOGGLE: J3.11 ; also sheet 2
!SYSTEM_EN: J3.12 R85.1 ; also sheet 2
+1V8 [Power]: J13.2 J20.1 J20.3 J20.5 ; also sheet 1
+3V3 [Power]: J12.2 J14.1 J14.2 J15.1 J15.2 J16.1 J16.2 J17.1 J17.2 J19.1 J19.3 J19.5 J21.1 J21.2 R14.2 R15.2 ; also sheet 1,2
+5V0 [Power]: C72.1 D1.1(C) J11.2 J18.1 J18.3 J18.5 J22.2 R81.2 U19.8(_P:V+) ; also sheet 1,2
+12V: J23.2 ; also sheet 1
-5V0 [Power]: C73.2 D2.2(A) U19.4(_P:V-) ; supply symbol labelled -5V ; also sheet 1,2
ANALOGUE_IN: D1.2(A) D2.1(C) J9.2 ; also sheet 2
FILT_SELECT0: J3.5 ; also sheet 2
FILT_SELECT1: J3.7 ; also sheet 2
FILT_SELECT2: J3.9 ; also sheet 2
FILTER_OUT_BUFF: J10.1 R79.2 ; also sheet 2
GND [GND]: C71.2 C72.2 C73.1 J2.3 J2.4 J3.3 J3.4 J4.3 J4.4 J5.3 J5.4 J6.3 J6.4 J7.3 J7.4 J7.11 J8.1 J9.1 J10.2 J11.1 J12.1 J13.1 J14.3 J14.4 J15.3 J15.4 J16.3 J16.4 J17.3 J17.4 J18.2 J18.4 J18.6 J19.2 J19.4 J19.6 J20.2 J20.4 J20.6 J21.3 J21.4 J22.1 J23.1 R43.1 R82.1 R84.2 R85.2 ; also sheet 1,2,3,4
INPUT_SELECT0: J3.10 ; also sheet 2
INPUT_SELECT1: J3.8 ; also sheet 2
INPUT_SELECT2: J3.6 ; also sheet 2
JB1: J6.12 J16.12
JB2: J6.10 J16.10
JB3: J6.8 J16.8
JB4: J6.6 J16.6
JB7: J6.11 J16.11
JB8: J6.9 J16.9
JB9: J6.7 J16.7
JB10: J6.5 J16.5
JC1: J5.12 J15.12
JC2: J5.10 J15.10
JC3: J5.8 J15.8
JC4: J5.6 J15.6
JC7: J5.11 J15.11
JC8: J5.9 J15.9
JC9: J5.7 J15.7
JC10: J5.5 J15.5
JD1: J4.12 J14.12
JD2: J4.10 J14.10
JD3: J4.8 J14.8
JD4: J4.6 J14.6
JD7\: J4.11 J14.11
JD8: J4.9 J14.9
JD9: J4.7 J14.7
JD10: J4.5 J14.5
JF7: J2.11 J17.11
JF8: J2.9 J17.9
N$73: J7.12 R43.2 R83.1 U19.7(_B:OUT)
N$74: R83.2 R84.1 U19.6(_B:-IN)
SCL: J2.10 J17.10 R14.1 ; also sheet 2
SDA: J2.8 J17.8 R15.1 ; also sheet 2
UART0_RX: J2.7 J17.7
UART0_TX: J2.5 J17.5
UART1_RX: J2.12 J17.12
UART1_TX: J2.6 J17.6
XADC_J14: J7.5 J21.5
XADC_J16: J7.7 J21.7
XADC_K14: J7.6 J21.6
XADC_K16: J7.8 J21.8
XADC_L14: J7.10 J21.10
XADC_L15: J7.9 J21.9
XADC_N1: C71.1 R81.1 R82.2 U19.3(_A:+IN)
XADC_N15: R79.1 R80.2 U19.5(_B:+IN)
Unconnected: J2.1 J2.2 J3.1 J3.2 J4.1 J4.2 J5.1 J5.2 J6.1 J6.2 J7.1 J7.2 J8.3 J21.11 J21.12

### Notes on the sheet
- Power Connectors
- PMOD Breakouts
- NC
- NC
- Board Control
  Signals
- Communication Breakout
- I2C Pullups
- NC | NC
- NC | NC
- NC
- NC
- Filter Inputs/Output
- NC
- NC
- Level Shifter
  Power
- NC
- NC
- NC
- -5V-+5V Swing
- NC
- NC
- 0.1% | 0.1%
- 0-1V Out
- Level shifter
- 0.1%
- 0.1%
- D1 & D2
- 0.1%
- 0.5V
- 0.1%

## Library data of the parts
1V8 3V3 +5V -5V0 G1-G4 = testpad:TP: Test pad
C1-C14 C16-C21 = rcl:C-US: CAPACITOR, American symbol; SPICEPREFIX: C
C15 = Filter Board:CGA9N3X7R1_CGA9N3X7R1C476M230KB; MANUFACTURER_PART_NUMBER: CGA9N3X7R1C476M230KB; VENDOR: TDK
C22-C73 = Capacitors:NON_POL
D1 D2 = Diodes:SCHOTTKY_DIODE
D3 = 50WQ04FN:VS-50WQ04FNPBF; MANUFACTURER_PART_NUMBER: VS50WQ04FNPBF; VENDOR: Vishay
D4 = SparkFun-LED:LED-BLUE: Blue SMD LED Used in manufacturing of various products at SparkFun Packages: 0603 - SMD 0603 package [Product Link] <http://www.digikey.com/product-detail/en/SMLE12BC7TT86/511-1589-2-ND/1641808> 1206 - SMD1206 package [Product Link] <http://www.digikey.com/product-detail/en/lite-on-inc/LTST-C150TBKT/160-1643-1-ND/573584> SparkFun Products: ESP8266 Thing-Dev Board <https://www.sparkfun.com/products/13711> RedBoard <https://www.sparkfun.com/products/12757>; PROD_ID: DIO-09911; VALUE: BLUE
J1 = con-jack:DCJ0202: DC POWER JACK Source: DCJ0202.pdf; OC_FARNELL: unknown; OC_NEWARK: unknown
J2-J7 J14-J17 J21 = Connectors:FEMALE_HEADER-2X6
J8 = SJ1-3523N:SJ1-3523N: 3.5 mm Right-Angle Stereo Jack, 3 Pin PCB Mount, Non-Threaded; AVAILABILITY: Unavailable; CUI_PURCHASE_URL: https://www.cuidevices.com/product/interconnect/connectors/audio-connectors/jacks/sj1-352xn-series?utm_source=snapeda.com&utm_medium=referral&utm_campaign=snapedaBOM; DESCRIPTION: 3.5 mm, Stereo, Right Angle, Through Hole, Audio Jack Connector; MF: CUI Devices; MP: SJ1-3523N; PACKAGE: None; PRICE: None
J9 J10 J22 J23 = SparkFun-Connectors:CONN_02: Multi connection point. Often used as Generic Header-pin footprint for 0.1 inch spaced/style header connections On any of the 0.1 inch spaced packages, you can populate with these: Break Away Headers - Straight <https://www.sparkfun.com/products/116> (PRT-00116) Break Away Male Headers - Right Angle <https://www.sparkfun.com/products/553> (PRT-00553) Female Headers <https://www.sparkfun.com/products/115> (PRT-00115) Break Away Headers - Machine Pin <https://www.sparkfun.com/products/117> (PRT-00117) Break Away Female Headers - Swiss Machine Pin <https://www.sparkfun.com/products/743> (PRT-00743) For SCREWTERMINALS and SPRING TERMINALS visit here: Screw Terimnals on SparkFun.com <https://www.sparkfun.com/search/results?term=Screw+Terminals> (5mm/3.5mm/2.54mm spacing) This device is also useful as a general connection point to wire up your design to another part of your project. Our various solder wires solder well into these plated through hole pads. Hook-Up Wire - Assortment (Stranded, 22 AWG) <https://www.sparkfun.com/products/11375> (PRT-11375) Hook-Up Wire - Assortment (Solid Core, 22 AWG) <https://www.sparkfun.com/products/11367> (PRT-11367) View the entire wire category on our website here <https://www.sparkfun.com/categories/141> Special notes: Molex polarized connector foot print use with: PRT-08233 with associated crimp pins and housings. 2.54_SCREWTERM for use with PRT-10571. 3.5mm Screw Terminal footprints for PRT-08084 5mm Screw Terminal footprints for use with PRT-08432
J11-J13 = SparkFun-Connectors:CONN_03: Multi connection point. Often used as Generic Header-pin footprint for 0.1 inch spaced/style header connections On any of the 0.1 inch spaced packages, you can populate with these: Break Away Headers - Straight <https://www.sparkfun.com/products/116> (PRT-00116) Break Away Male Headers - Right Angle <https://www.sparkfun.com/products/553> (PRT-00553) Female Headers <https://www.sparkfun.com/products/115> (PRT-00115) Break Away Headers - Machine Pin <https://www.sparkfun.com/products/117> (PRT-00117) Break Away Female Headers - Swiss Machine Pin <https://www.sparkfun.com/products/743> (PRT-00743) Stackable Header - 3 Pin (Female, 0.1") <https://www.sparkfun.com/products/13875> (PRT-13875) For SCREWTERMINALS and SPRING TERMINALS visit here: Screw Terimnals on SparkFun.com <https://www.sparkfun.com/search/results?term=Screw+Terminals> (5mm/3.5mm/2.54mm spacing) This device is also useful as a general connection point to wire up your design to another part of your project. Our various solder wires solder well into these plated through hole pads. Hook-Up Wire - Assortment (Stranded, 22 AWG) <https://www.sparkfun.com/products/11375> (PRT-11375) Hook-Up Wire - Assortment (Solid Core, 22 AWG) <https://www.sparkfun.com/products/11367> (PRT-11367) View the entire wire category on our website here <https://www.sparkfun.com/categories/141> Special notes: Molex polarized connector foot print use with SKU : PRT-08232 with associated crimp pins and housings.
J18-J20 = SparkFun-Connectors:CONN_03X2: Multi connection point. Often used as Generic Header-pin footprint for 0.1 inch spaced/style header connections You can populate with any combo of single row headers, but if you'd like an exact match, check these: Header - 2x3 (Male, 0.1") <https://www.sparkfun.com/products/12807> (PRT-12807) Header - 2x3 (Female, 0.1") <https://www.sparkfun.com/products/13010> (PRT-13010) 2x3 Pin Shrouded Header <https://www.sparkfun.com/products/10877> (PRT-10877) On any of the 0.1 inch spaced packages, you can populate with these: Break Away Headers - Straight <https://www.sparkfun.com/products/116> (PRT-00116) Break Away Male Headers - Right Angle <https://www.sparkfun.com/products/553> (PRT-00553) Female Headers <https://www.sparkfun.com/products/115> (PRT-00115) Break Away Headers - Machine Pin <https://www.sparkfun.com/products/117> (PRT-00117) Break Away Female Headers - Swiss Machine Pin <https://www.sparkfun.com/products/743> (PRT-00743) Special note: the shrouded connector mates well with our 3x2 ribbon cables: Ribbon Crimp Connector - 6-pin (2x3, Female) <https://www.sparkfun.com/products/10651> (PRT-10651) Ribbon Cable - 6 wire (15ft) <https://www.sparkfun.com/products/10646> (PRT-10646); PROD_ID: CONN-11566; VALUE: FEMALE 2x3
L1 = Filter Board:IHLP-3232DZ_IHLP3232DZER4R7M11; MANUFACTURER_PART_NUMBER: IHLP3232DZER4R7M11; VENDOR: VISHAY
L2 = LTF5022T:LTF5022T
L3 = NCLV32T:NLCV32T-2R2M-PFR; MANUFACTURER_PART_NUMBER: NLCV32T-2R2M-PFR; VENDOR: TDK
L4 = Filter Board:IFSC-1515A_IFSC1515AHER150M01; MANUFACTURER_PART_NUMBER: IFSC1515AHER150M01; VENDOR: VISHAY
R1-R13 = rcl:R-US_: RESISTOR, American symbol; SPICEPREFIX: R
R14 R15 R18 R20 R22 R24 R26 R27 R29 R30 R33 R35 R37-R42 R44-R67 R70 R71 R74 R75 R78-R85 = Resistors:SMD
R16 R17 R19 R21 R23 R25 R28 R31 R32 R34 R36 R43 R68 R69 R72 R73 R76 R77 = Resistors:SMD; BOM: DNU
U1 = TPS54531DDAR:TPS54531DDAR; MANUFACTURER_PART_NUMBER: TPS54531DDAR; VENDOR: Texas Instruments
U3 U4 = TPS56339:TPS56339
U5 = LM3601PWP:LM43601PWPR; MANUFACTURER_PART_NUMBER: LM43601PWPR; VENDOR: Texas Instruments
U6-U9 = Potentiometer:X9258
U10 U11 U18 = Digital ICs:CD74HCT4051: TI 8x1 analog multiplexer/demultiplexer. Datasheet: http://www.ti.com/lit/ds/symlink/cd74hct4053.pdf
U12-U16 = Amplifiers:OPA4197
U17 = Digital ICs:CD74HCT4053: TI 3 2x1 analog multiplexer/demultiplexer. Datasheet: http://www.ti.com/lit/ds/symlink/cd74hct4053.pdf
U19 = Amplifiers:OPA2197

## Net classes
0 default: width 0.254 mm
1 Power: width 0.254 mm, clearance 0.203 mm to class 0
2 GND: width 0.254 mm, clearance 0.203 mm to class 0, clearance 0.254 mm to class 1